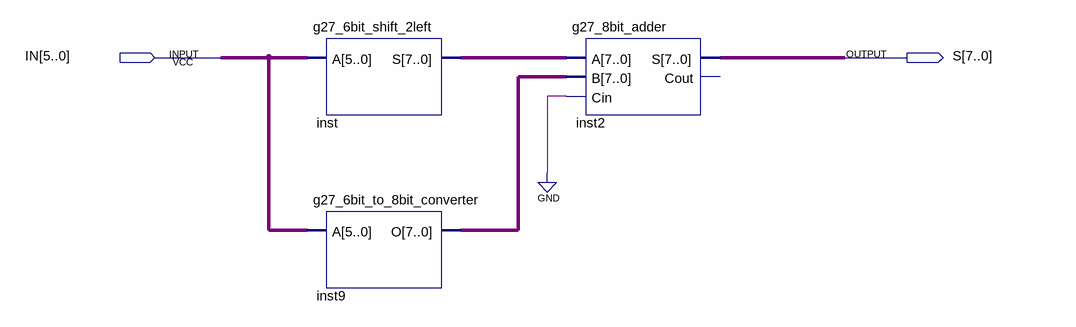
[diagram p0: schematic sheet]
// Quartus schematic testing2.bdf as structural Verilog: 3 symbols, 2 pins
module testing2 (
  input  [5:0] IN,
  output [7:0] S
);

  wire [7:0] inst9_o, inst_s;

  g27_6bit_shift_2left inst (.A(IN), .S(inst_s));
  g27_6bit_to_8bit_converter inst9 (.A(IN), .O(inst9_o));
  g27_8bit_adder inst2 (.A(inst_s), .B(inst9_o), .Cin(1'b0), .S(S));  // open: Cout
endmodule
